# EasyEDA Pro project ProDocument_LN_CTRL_V1_2026-03-25.epro, schematic Schematic1, sheets 4 to 5 of 5

## Sheets
4 ADC: Create Date: 2026-01-05; Page Name: ADC; Project Name: ProDocument_LN_CTRL_V1; Update Date: 2026-01-05
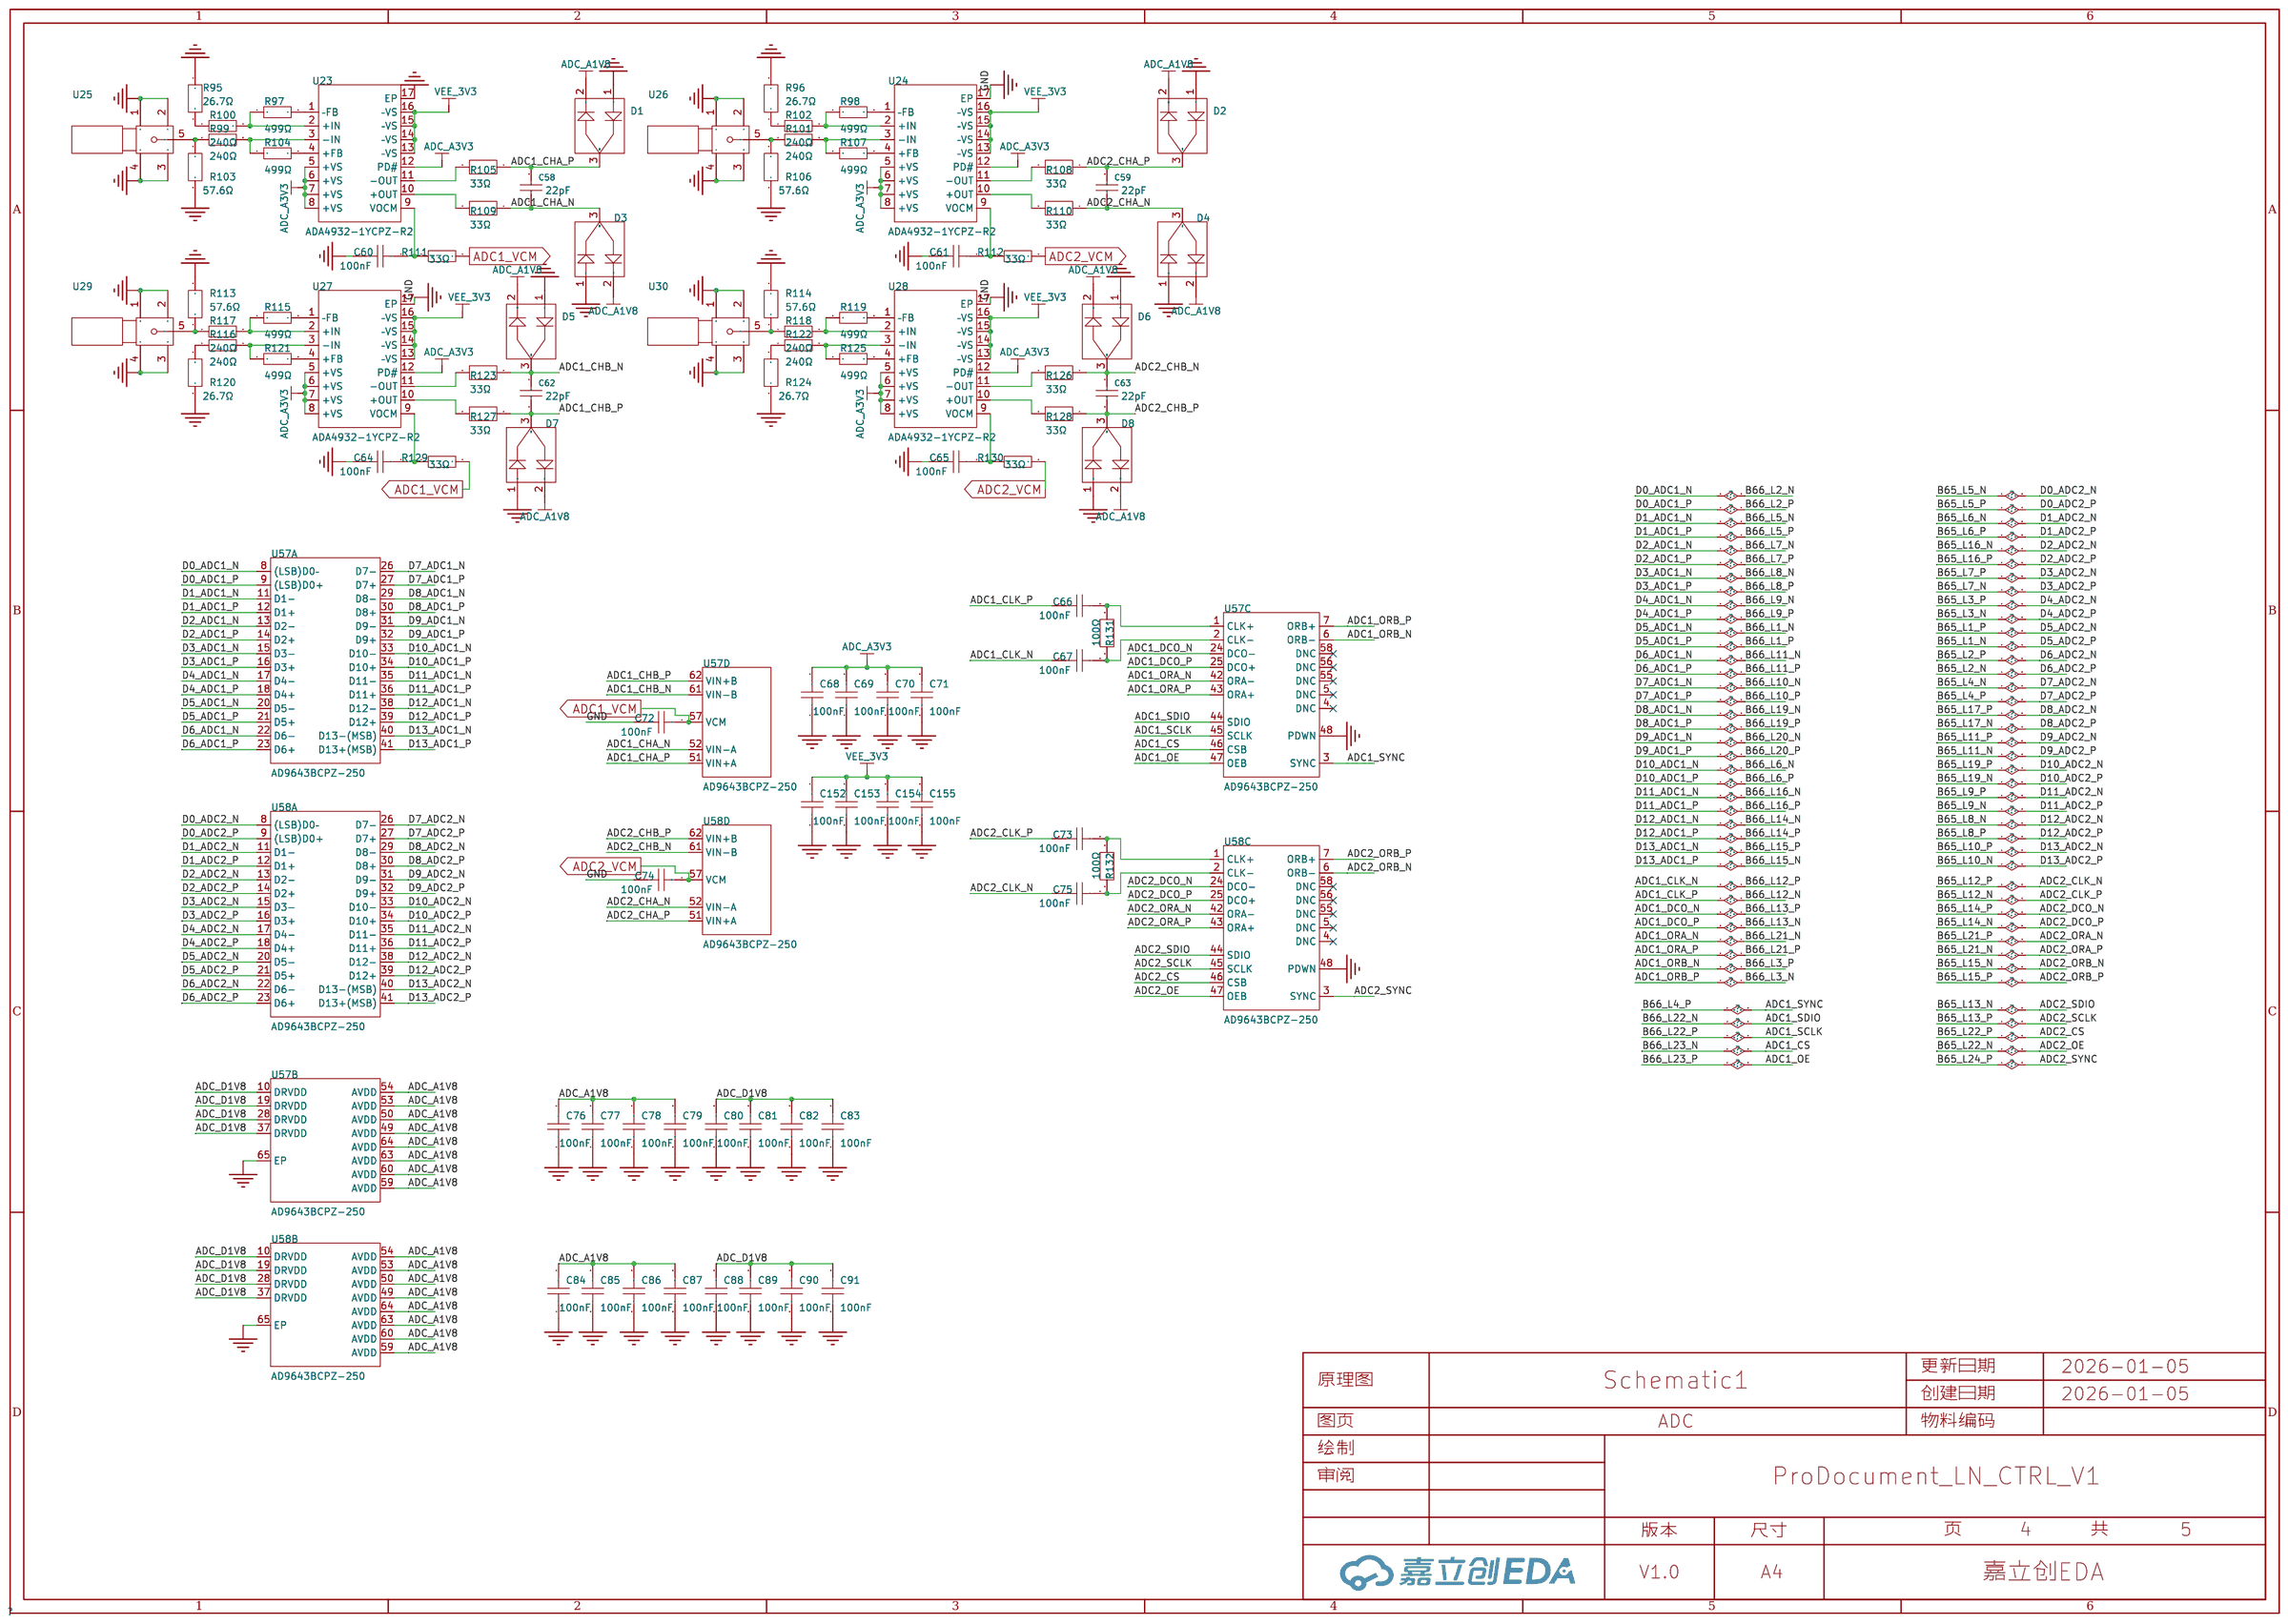
[diagram p3: ADC]
5 POWER: Create Date: 2026-01-05; Page Name: POWER; Project Name: ProDocument_LN_CTRL_V1; Update Date: 2026-01-05
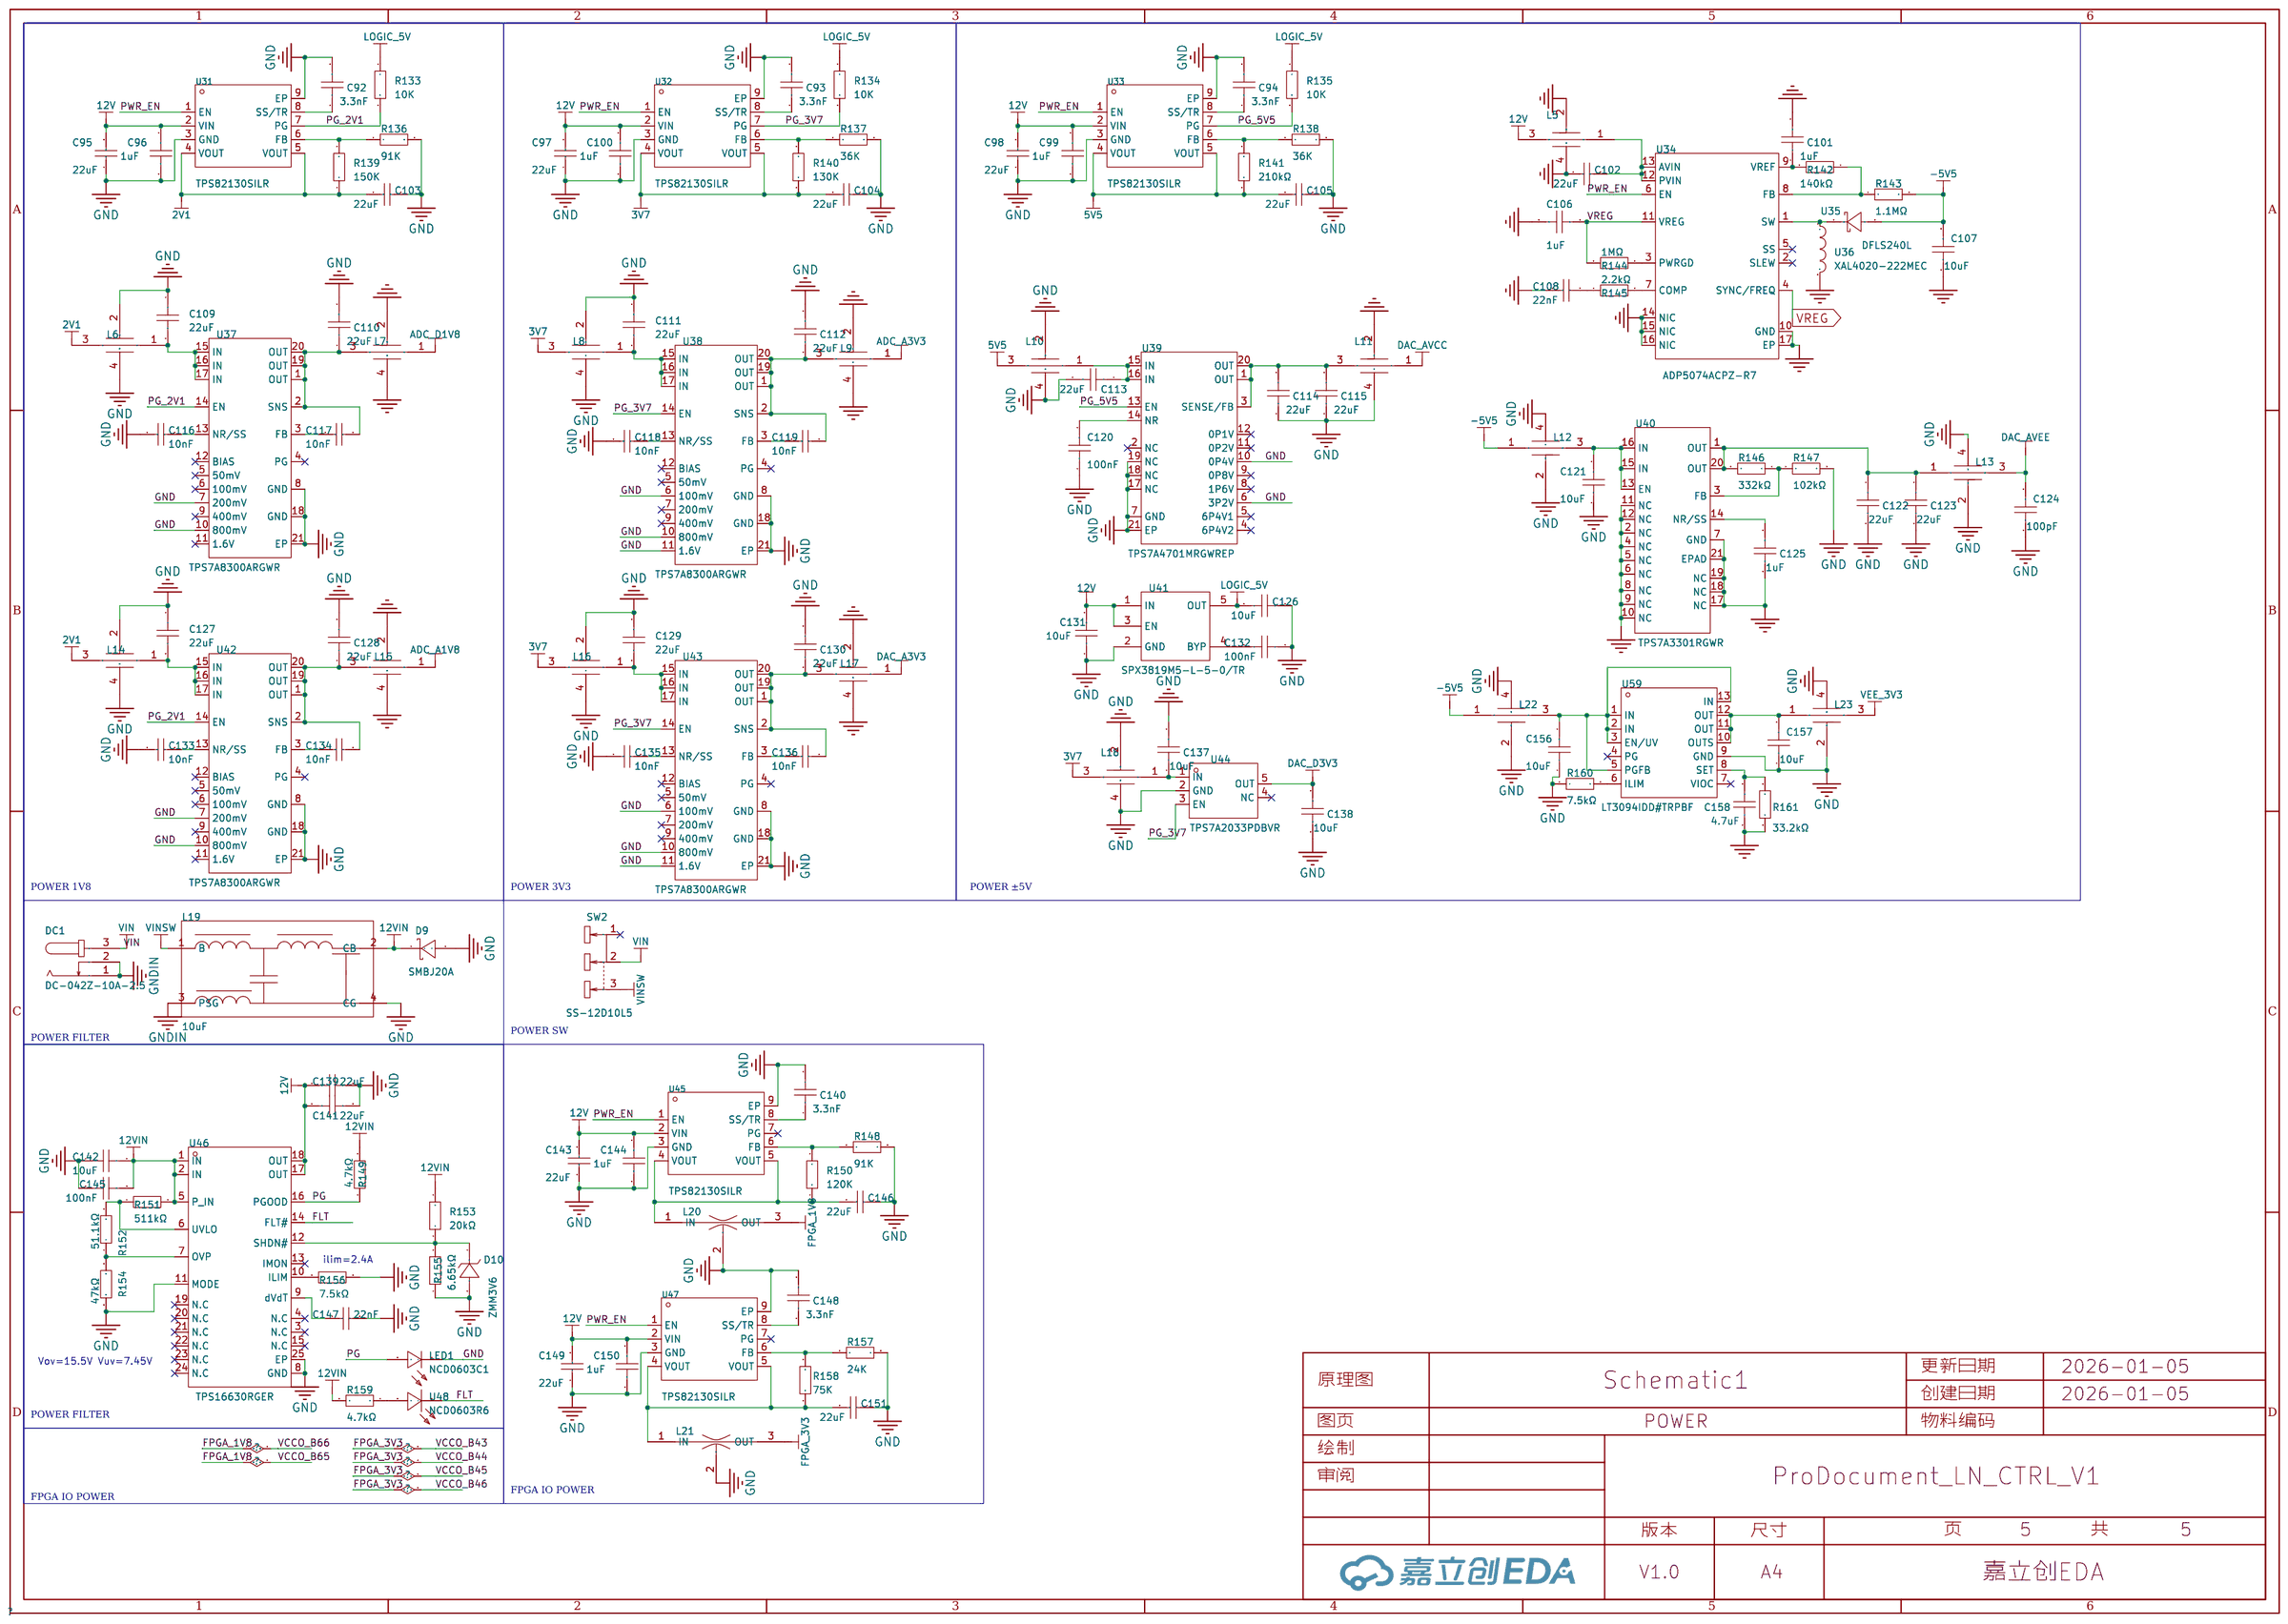
[diagram p4: POWER]

## Parts
sheet ADC
C58  22pF  [C0402]
C59  22pF  [C0402]
C60  100nF  [C0402]
C61  100nF  [C0402]
C62  22pF  [C0402]
C63  22pF  [C0402]
C64  100nF  [C0402]
C65  100nF  [C0402]
C66  100nF  [C0402]
C67  100nF  [C0402]
C68  100nF  [C0402]
C69  100nF  [C0402]
C70  100nF  [C0402]
C71  100nF  [C0402]
C72  100nF  [C0402]
C73  100nF  [C0402]
C74  100nF  [C0402]
C75  100nF  [C0402]
C76  100nF  [C0402]
C77  100nF  [C0402]
C78  100nF  [C0402]
C79  100nF  [C0402]
C80  100nF  [C0402]
C81  100nF  [C0402]
C82  100nF  [C0402]
C83  100nF  [C0402]
C84  100nF  [C0402]
C85  100nF  [C0402]
C86  100nF  [C0402]
C87  100nF  [C0402]
C88  100nF  [C0402]
C89  100nF  [C0402]
C90  100nF  [C0402]
C91  100nF  [C0402]
C152  100nF  [C0402]
C153  100nF  [C0402]
C154  100nF  [C0402]
C155  100nF  [C0402]
D1  NSVR351SDSA3T1G  [SC-59-3_L2.9-W1.5-P0.95-LS2.5-BR]
D2  NSVR351SDSA3T1G  [SC-59-3_L2.9-W1.5-P0.95-LS2.5-BR]
D3  NSVR351SDSA3T1G  [SC-59-3_L2.9-W1.5-P0.95-LS2.5-BR]
D4  NSVR351SDSA3T1G  [SC-59-3_L2.9-W1.5-P0.95-LS2.5-BR]
D5  NSVR351SDSA3T1G  [SC-59-3_L2.9-W1.5-P0.95-LS2.5-BR]
D6  NSVR351SDSA3T1G  [SC-59-3_L2.9-W1.5-P0.95-LS2.5-BR]
D7  NSVR351SDSA3T1G  [SC-59-3_L2.9-W1.5-P0.95-LS2.5-BR]
D8  NSVR351SDSA3T1G  [SC-59-3_L2.9-W1.5-P0.95-LS2.5-BR]
R95  26.7Ω  [R0402]
R96  26.7Ω  [R0402]
R97  499Ω  [R0402]
R98  499Ω  [R0402]
R99  240Ω  [R0402]
R100  240Ω  [R0402]
R101  240Ω  [R0402]
R102  240Ω  [R0402]
R103  57.6Ω  [R0402]
R104  499Ω  [R0402]
R105  33Ω  [R0402]
R106  57.6Ω  [R0402]
R107  499Ω  [R0402]
R108  33Ω  [R0402]
R109  33Ω  [R0402]
R110  33Ω  [R0402]
R111  33Ω  [R0402]
R112  33Ω  [R0402]
R113  57.6Ω  [R0402]
R114  57.6Ω  [R0402]
R115  499Ω  [R0402]
R116  240Ω  [R0402]
R117  240Ω  [R0402]
R118  240Ω  [R0402]
R119  499Ω  [R0402]
R120  26.7Ω  [R0402]
R121  499Ω  [R0402]
R122  240Ω  [R0402]
R123  33Ω  [R0402]
R124  26.7Ω  [R0402]
R125  499Ω  [R0402]
R126  33Ω  [R0402]
R127  33Ω  [R0402]
R128  33Ω  [R0402]
R129  33Ω  [R0402]
R130  33Ω  [R0402]
R131  100Ω  [R0402]
R132  100Ω  [R0402]
U23  ADA4932-1YCPZ-R2  [LFCSP-16_L3.0-W3.0-P0.50-BL-EP1.3]
U24  ADA4932-1YCPZ-R2  [LFCSP-16_L3.0-W3.0-P0.50-BL-EP1.3]
U25  -  [MOLEX_SMA]
U26  -  [MOLEX_SMA]
U27  ADA4932-1YCPZ-R2  [LFCSP-16_L3.0-W3.0-P0.50-BL-EP1.3]
U28  ADA4932-1YCPZ-R2  [LFCSP-16_L3.0-W3.0-P0.50-BL-EP1.3]
U29  -  [MOLEX_SMA]
U30  -  [MOLEX_SMA]
U57  AD9643BCPZ-250  [LFCSP-64_L9.0-W9.0-P0.50-BL-EP6.2]  (sections 1,2,3,4)
U58  AD9643BCPZ-250  [LFCSP-64_L9.0-W9.0-P0.50-BL-EP6.2]  (sections 1,2,3,4)
sheet POWER
C92  3.3nF  [C0402]
C93  3.3nF  [C0402]
C94  3.3nF  [C0402]
C95  22uF  [C0805]
C96  1uF  [C0402]
C97  22uF  [C0805]
C98  22uF  [C0805]
C99  1uF  [C0402]
C100  1uF  [C0402]
C101  1uF  [C0603]
C102  22uF  [C0805]
C103  22uF  [C0805]
C104  22uF  [C0805]
C105  22uF  [C0805]
C106  1uF  [C0603]
C107  10uF  [C0603]
C108  22nF  [C0402]
C109  22uF  [C0805]
C110  22uF  [C0805]
C111  22uF  [C0805]
C112  22uF  [C0805]
C113  22uF  [C0805]
C114  22uF  [C0805]
C115  22uF  [C0805]
C116  10nF  [C0402]
C117  10nF  [C0402]
C118  10nF  [C0402]
C119  10nF  [C0402]
C120  100nF  [C0402]
C121  10uF  [C0603]
C122  22uF  [C0805]
C123  22uF  [C0805]
C124  100pF  [C0402]
C125  1uF  [C0603]
C126  10uF  [C0603]
C127  22uF  [C0805]
C128  22uF  [C0805]
C129  22uF  [C0805]
C130  22uF  [C0805]
C131  10uF  [C0603]
C132  100nF  [C0402]
C133  10nF  [C0402]
C134  10nF  [C0402]
C135  10nF  [C0402]
C136  10nF  [C0402]
C137  10uF  [C0603]
C138  10uF  [C0603]
C139  22uF  [C1206]
C140  3.3nF  [C0402]
C141  22uF  [C1206]
C142  10uF  [C0805]
C143  22uF  [C0805]
C144  1uF  [C0402]
C145  100nF  [C0402]
C146  22uF  [C0805]
C147  22nF  [C0402]
C148  3.3nF  [C0402]
C149  22uF  [C0805]
C150  1uF  [C0402]
C151  22uF  [C0805]
C156  10uF  [C0603]
C157  10uF  [C0603]
C158  4.7uF  [C0402]
D9  SMBJ20A  [SMB_L4.5-W3.7-LS5.4-RD]
D10  ZMM3V6  [LL-34_L3.5-W1.5-RD]
DC1  DC-042Z-10A-2.5  [DC-IN-TH_DC-042C-Z-2.5-A]
L5  NFM21PC104R1E3D  [CAP-SMD_4P-L2.0-W1.25]
L6  NFM21PC104R1E3D  [CAP-SMD_4P-L2.0-W1.25]
L7  NFM21PC104R1E3D  [CAP-SMD_4P-L2.0-W1.25]
L8  NFM21PC104R1E3D  [CAP-SMD_4P-L2.0-W1.25]
L9  NFM21PC104R1E3D  [CAP-SMD_4P-L2.0-W1.25]
L10  NFM21PC104R1E3D  [CAP-SMD_4P-L2.0-W1.25]
L11  NFM21PC104R1E3D  [CAP-SMD_4P-L2.0-W1.25]
L12  NFM21PC104R1E3D  [CAP-SMD_4P-L2.0-W1.25]
L13  NFM21PC104R1E3D  [CAP-SMD_4P-L2.0-W1.25]
L14  NFM21PC104R1E3D  [CAP-SMD_4P-L2.0-W1.25]
L15  NFM21PC104R1E3D  [CAP-SMD_4P-L2.0-W1.25]
L16  NFM21PC104R1E3D  [CAP-SMD_4P-L2.0-W1.25]
L17  NFM21PC104R1E3D  [CAP-SMD_4P-L2.0-W1.25]
L18  NFM21PC104R1E3D  [CAP-SMD_4P-L2.0-W1.25]
L19  10uF  [FILTER-SMD_BNX026H01L]
L20  NFM18PC105R0J3D  [FILTER-SMD_3P-L1.6-W0.8-L]
L21  NFM18PC105R0J3D  [FILTER-SMD_3P-L1.6-W0.8-L]
L22  NFM21PC104R1E3D  [CAP-SMD_4P-L2.0-W1.25]
L23  NFM21PC104R1E3D  [CAP-SMD_4P-L2.0-W1.25]
LED1  NCD0603C1  [LED0603-RD]
R133  10K  [R0402]
R134  10K  [R0402]
R135  10K  [R0402]
R136  91K  [R0402]
R137  36K  [R0402]
R138  36K  [R0402]
R139  150K  [R0402]
R140  130K  [R0402]
R141  210kΩ  [R0402]
R142  140kΩ  [R0402]
R143  1.1MΩ  [R0402]
R144  1MΩ  [R0402]
R145  2.2kΩ  [R0402]
R146  332kΩ  [R0402]
R147  102kΩ  [R0402]
R148  91K  [R0402]
R149  4.7kΩ  [R0402]
R150  120K  [R0402]
R151  511kΩ  [R0402]
R152  51.1kΩ  [R0402]
R153  20kΩ  [R0402]
R154  47kΩ  [R0402]
R155  6.65kΩ  [R0402]
R156  7.5kΩ  [R0402]
R157  24K  [R0402]
R158  75K  [R0402]
R159  4.7kΩ  [R0402]
R160  7.5kΩ  [R0402]
R161  33.2kΩ  [R0402]
SW2  SS-12D10L5  [SW-TH_SS-12D10L5]
U31  TPS82130SILR  [USIP-8_L3.0-W2.8-P0.65-TL-EP]
U32  TPS82130SILR  [USIP-8_L3.0-W2.8-P0.65-TL-EP]
U33  TPS82130SILR  [USIP-8_L3.0-W2.8-P0.65-TL-EP]
U34  ADP5074ACPZ-R7  [LFCSP-16_L3.0-W3.0-P0.50-BL-EP1.7]
U35  DFLS240L  [POWERDI-123_L2.8-W1.8-LS3.7-RD]
U36  XAL4020-222MEC  [IND-SMD_L4.0-W4.0-A]
U37  TPS7A8300ARGWR  [VQFN-20_L5.0-W5.0-P0.65-TL-EP3.2]
U38  TPS7A8300ARGWR  [VQFN-20_L5.0-W5.0-P0.65-TL-EP3.2]
U39  TPS7A4701MRGWREP  [VQFN-20_L5.0-W5.0-P0.65-TL-EP3.2]
U40  TPS7A3301RGWR  [VQFN-20_L5.0-W5.0-P0.65-TL-EP]
U41  SPX3819M5-L-5-0/TR  [SOT-23-5_L3.0-W1.7-P0.95-LS2.8-BL]
U42  TPS7A8300ARGWR  [VQFN-20_L5.0-W5.0-P0.65-TL-EP3.2]
U43  TPS7A8300ARGWR  [VQFN-20_L5.0-W5.0-P0.65-TL-EP3.2]
U44  TPS7A2033PDBVR  [SOT-23-5_L2.9-W1.6-P0.95-LS2.8-BR]
U45  TPS82130SILR  [USIP-8_L3.0-W2.8-P0.65-TL-EP]
U46  TPS16630RGER  [VFQFPN-24_L4.0-W4.0-P0.50-BL-EP2.8]
U47  TPS82130SILR  [USIP-8_L3.0-W2.8-P0.65-TL-EP]
U48  NCD0603R6  [LED0603-RD]
U59  LT3094IDD#TRPBF  [DFN-12_L3.0-W3.0-P0.45-BL-EP-1]

## Library data of the parts
C58 C59 C62 C63 = 0402CG220J500NT: 容值:22pF;精度:±5%;额定电压:50V;材质(温度系数):C0G;; LCSC Part Name: 22pF ±5% 50V; Supplier Part: C1555; Manufacturer: FH(风华); Supplier Footprint: 0402; JLCPCB Part Class: 基础库; Datasheet: https://atta.szlcsc.com/upload/public/pdf/source/20200305/C486355_26A10D38EF8C2A5C37091D0039909270.pdf; Supplier: LCSC; Tolerance: ±5%; Voltage Rated: 50V; Temperature Coefficient: C0G
C60 C61 C64-C91 C120 C132 C145 C152-C155 = GRM155R71H104KE14D: 容值:100nF;精度:±10%;额定电压:50V;材质(温度系数):X7R;; LCSC Part Name: 100nF ±10% 50V; Supplier Part: C77020; Manufacturer: muRata(村田); Supplier Footprint: 0402; JLCPCB Part Class: 扩展库; Datasheet: https://atta.szlcsc.com/upload/public/pdf/source/20180326/C77020_39BD49C951FF1AF0DB1F1FAC5AC1E401.pdf; Supplier: LCSC; Tolerance: ±10%; Voltage Rated: 50V; Temperature Coefficient: X7R
D1-D8 = NSVR351SDSA3T1G: 二极管配置:1对串联式;正向压降(Vf):230mV@1mA;直流反向耐压(Vr):5V;整流电流:30mA;; LCSC Part Name: 电压:5V 电流:30mA; Supplier Part: C604385; Manufacturer: onsemi(安森美); Supplier Footprint: SC-59; JLCPCB Part Class: 扩展库; Datasheet: https://item.szlcsc.com/datasheet/NSVR351SDSA3T1G/633813.html; Supplier: LCSC; Diode Configuration: 1对串联式; Voltage - Forward(Vf@If): 230mV@1mA; Voltage - DC Reverse(Vr): 5V; Current - Rectified: 30mA; Reverse Leakage Current (Ir): 25uA@0.5V
R95 R96 R103 R105 R106 R108-R110 R113 R114 R120 R123 R124 R126-R128 = ARG02BTC1001: 阻值:1kΩ;精度:±0.1%;温度系数:±25ppm/;; LCSC Part Name: 1kΩ ±0.1%; Supplier Part: C2984405; Manufacturer: Viking(光颉); Supplier Footprint: 0402; Datasheet: https://atta.szlcsc.com/upload/public/pdf/source/20200117/C485675_99063924B4564AF910B7BE66DA8EFA49.pdf; Supplier: LCSC; Tolerance: ±0.1%; Temperature Coefficient: ±25ppm/
R97 R98 R104 R107 R115 R119 R121 R125 = 0402WGF4990TCE: 电阻类型:厚膜电阻;阻值:499Ω;精度:±1%;功率:62.5mW;最大工作电压:50V;温度系数:±100ppm/℃;; LCSC Part Name: 499Ω ±1% 62.5mW 厚膜电阻; Supplier Part: C4125; Manufacturer: UNI-ROYAL(厚声); Supplier Footprint: 0402; JLCPCB Part Class: 扩展库; Datasheet: https://atta.szlcsc.com/upload/public/pdf/source/20200306/C422600_1E6D84923E4A46A82E41ADD87F860B5C.pdf; Supplier: LCSC; Type: 厚膜电阻; Tolerance: ±1%; Power(Watts): 62.5mW; Overload Voltage (Max): 50V; Temperature Coefficient: ±100ppm/℃; Operating Temperature Range: -55℃~+155℃
R99-R102 R116-R118 R122 = 0402WGF2400TCE: 电阻类型:厚膜电阻;阻值:240Ω;精度:±1%;功率:62.5mW;最大工作电压:50V;温度系数:±100ppm/℃;; LCSC Part Name: 240Ω ±1% 62.5mW 厚膜电阻; Supplier Part: C25094; Manufacturer: UNI-ROYAL(厚声); Supplier Footprint: 0402; JLCPCB Part Class: 扩展库; Datasheet: https://atta.szlcsc.com/upload/public/pdf/source/20200306/C422600_1E6D84923E4A46A82E41ADD87F860B5C.pdf; Supplier: LCSC; Type: 厚膜电阻; Tolerance: ±1%; Power(Watts): 62.5mW; Overload Voltage (Max): 50V; Temperature Coefficient: ±100ppm/℃; Operating Temperature Range: -55℃~+155℃
R111 R112 R129 R130 = 0402WGF330JTCE: 电阻类型:厚膜电阻;阻值:33Ω;精度:±1%;功率:62.5mW;工作电压:50V;温度系数:±100ppm/℃;; LCSC Part Name: 33Ω ±1% 62.5mW 厚膜电阻; Supplier Part: C25105; Manufacturer: UNI-ROYAL(厚声); Supplier Footprint: 0402; JLCPCB Part Class: 基础库; Datasheet: https://item.szlcsc.com/datasheet/0402WGF330JTCE/25848.html; Supplier: LCSC; Type: 厚膜电阻; Tolerance: ±1%; Power(Watts): 62.5mW; Voltage-Supply(Max): 50V; Temperature Coefficient: ±100ppm/℃; Operating Temperature: -55℃~+155℃
R131 R132 = RT0402BRD07100RL: 电阻类型:薄膜电阻;阻值:100Ω;精度:±0.1%;功率:62.5mW;工作电压:50V;温度系数:±25ppm/℃;; LCSC Part Name: 薄膜电阻 100Ω ±0.1% 62.5mW; Supplier Part: C705627; Manufacturer: YAGEO(国巨); Supplier Footprint: 0402; JLCPCB Part Class: 扩展库; Datasheet: https://atta.szlcsc.com/upload/public/pdf/source/20250609/0E6D5617EADA80FA3B707391883DF2D5.pdf; Supplier: LCSC; Type: 薄膜电阻; Tolerance: ±0.1%; Power(Watts): 62.5mW; Voltage-Supply(Max): 50V; Temperature Coefficient: ±25ppm/℃; Operating Temperature: -55℃~+155℃
U23 U24 U27 U28 = ADA4932-1YCPZ-R2: 放大器数:单路;共模抑制比(CMRR):100dB;输入偏置电流(Ib):2.5uA;输入失调电压(Vos):500uV;增益带宽积(GBP):-;压摆率(SR):2800V/us;带宽(-3db):560MHz;; LCSC Part Name: 高性能低功耗差分ADC驱动器; Supplier Part: C494505; Manufacturer: ADI(亚德诺); Supplier Footprint: LFCSP-16(3x3); JLCPCB Part Class: 扩展库; Datasheet: https://atta.szlcsc.com/upload/public/pdf/source/20200309/C494505_BB399B04ACF7E8080BF0845658E50F75.pdf; Supplier: LCSC; Number of Circuits: 单路; Common Mode Rejection Ratio (CMRR): 100dB; Current - Input Bias(Ib): 2.5uA; Voltage - Input Offset(Vos): 500uV; Slew Rate(SR): 2800V/us; Supply Voltage: 3V~5V; -3db Bandwidth: 560MHz; Input Offset Voltage Drift (Vos TC): 3.7uV/℃; Supply Current: 9.6mA; Operating Temperature: -40℃~+105℃
U25 U26 U29 U30 = MOLEX_SMA: C296128
U57 U58 = AD9643BCPZ-250: 接口:并行;电源电压:1.7V~1.9V;采样率:250MHz;分辨率:14;; LCSC Part Name: 14位，170 MSPS/210 MSPS/250 MSPS，1.8 V 双通道模数转换器（ADC）; Supplier Part: C653687; Manufacturer: ADI(亚德诺); Supplier Footprint: LFCSP-64(9x9); JLCPCB Part Class: 扩展库; Datasheet: https://atta.szlcsc.com/upload/public/pdf/source/20210202/C653686_A37F23B3A48DA588C28A43E276C751ED.pdf; Supplier: LCSC; Interface: 并行; differential input: 是; number of channels: 2; Supply Voltage: 1.7V~1.9V; sampling frequency: 250MHz; resolution: 14; Operating Temperature: -40℃~+85℃
C92-C94 C124 C140 C148 = CAP_0402: Supplier Footprint: 0402
C95 C97 C98 C102-C105 C143 C146 C149 C151 = GRM21BR61E226ME44L: 容值:22uF;精度:±20%;额定电压:25V;温度系数:X5R;; LCSC Part Name: 22uF ±20% 25V; Supplier Part: C86816; Manufacturer: muRata(村田); Supplier Footprint: 0805; JLCPCB Part Class: 扩展库; Datasheet: https://item.szlcsc.com/datasheet/GRM21BR61E226ME44L/87993.html; Supplier: LCSC; Tolerance: ±20%; Voltage Rating: 25V; Temperature Coefficient: X5R
C96 C99 C100 C144 C150 = CL05X105KA5NQNC: 容值:1uF;精度:±10%;额定电压:25V;材质(温度系数):X6S;; LCSC Part Name: 1uF ±10% 25V; Supplier Part: C307454; Manufacturer: SAMSUNG(三星); Supplier Footprint: 0402; JLCPCB Part Class: Extended Part; Datasheet: https://atta.szlcsc.com/upload/public/pdf/source/20160218/1457707763339.pdf; Supplier: LCSC; Tolerance: ±10%; Voltage Rated: 25V; Temperature Coefficient: X6S
C101 C106 C125 = GCM188R71E105KA64D: 容值:1uF;精度:±10%;额定电压:25V;温度系数:X7R;; LCSC Part Name: 1uF ±10% 25V; Supplier Part: C85862; Manufacturer: muRata(村田); Supplier Footprint: 0603; JLCPCB Part Class: 扩展库; Datasheet: https://item.szlcsc.com/datasheet/GCM188R71E105KA64D/87038.html; Supplier: LCSC; Tolerance: ±10%; Voltage Rating: 25V; Temperature Coefficient: X7R
C107 C121 C137 C138 C156 C157 = GRM188Z71A106KA73D: 容值:10uF;精度:±10%;额定电压:10V;材质(温度系数):X7R;; LCSC Part Name: 10uF ±10% 10V; Supplier Part: C2959727; Manufacturer: muRata(村田); Supplier Footprint: 0603; JLCPCB Part Class: 扩展库; Datasheet: https://atta.szlcsc.com/upload/public/pdf/source/20220328/6A4892B7E841253269A84FFE395E0578.pdf; Supplier: LCSC; Tolerance: ±10%; Voltage Rated: 10V; Temperature Coefficient: X7R
C108 C147 = GRM155R71H223KA12D: 容值:22nF;精度:±10%;额定电压:50V;材质(温度系数):X7R;; LCSC Part Name: 22nF ±10% 50V; Supplier Part: C77023; Manufacturer: muRata(村田); Supplier Footprint: 0402; JLCPCB Part Class: 扩展库; Datasheet: https://atta.szlcsc.com/upload/public/pdf/source/20180326/C77023_485AB0D0559A254D360F85D8E7719291.pdf; Supplier: LCSC; Tolerance: ±10%; Voltage Rated: 50V; Temperature Coefficient: X7R
C109-C112 C127-C130 = CL21A226MAQNNNE_C45783: 容值:22uF;精度:±20%;额定电压:25V;材质(温度系数):X5R;; LCSC Part Name: 22uF ±20% 25V; Supplier Part: C45783; Manufacturer: SAMSUNG(三星); Manufacturer Part: CL21A226MAQNNNE; Supplier Footprint: 0805; JLCPCB Part Class: 基础库; Datasheet: https://atta.szlcsc.com/upload/public/pdf/source/20160103/1457707727161.pdf; Supplier: LCSC; Tolerance: ±20%; Voltage Rated: 25V; Temperature Coefficient: X5R
C113-C115 = GRM21BC81C226ME44L: 容值:22uF;精度:±20%;额定电压:16V;材质(温度系数):X6S;; LCSC Part Name: 22uF ±20% 16V; Supplier Part: C258782; Manufacturer: muRata(村田); Supplier Footprint: 0805; JLCPCB Part Class: 扩展库; Datasheet: https://atta.szlcsc.com/upload/public/pdf/source/20200117/C258782_354729B55DBAD136BAA783E298FE5367.pdf; Supplier: LCSC; Tolerance: ±20%; Voltage Rated: 16V; Temperature Coefficient: X6S
C116-C119 C133-C136 = CL05B103KB5NNNC: 容值:10nF;精度:±10%;额定电压:50V;材质(温度系数):X7R;; LCSC Part Name: 10nF ±10% 50V; Supplier Part: C15195; Manufacturer: SAMSUNG(三星); Supplier Footprint: 0402; JLCPCB Part Class: 基础库; Datasheet: https://atta.szlcsc.com/upload/public/pdf/source/20160218/1457707763339.pdf; Supplier: LCSC; Tolerance: ±10%; Voltage Rated: 50V; Temperature Coefficient: X7R
C122 C123 = CAP_0805: Supplier Footprint: 0805
C126 C131 = CAP_0603: Supplier Footprint: 0603
C139 C141 = CGA1206X5R226M350NT: 容值:22uF;精度:±20%;额定电压:35V;材质(温度系数):X5R;; LCSC Part Name: 22uF ±20% 35V; Supplier Part: C6119969; Manufacturer: HRE(芯声); Supplier Footprint: 1206; JLCPCB Part Class: 扩展库; Supplier: LCSC; Tolerance: ±20%; Voltage Rated: 35V; Temperature Coefficient: X5R
C142 = GRM21BR61H106KE43L: 容值:10uF;精度:±10%;额定电压:50V;材质(温度系数):X5R;; LCSC Part Name: 10uF ±10% 50V; Supplier Part: C440198; Manufacturer: muRata(村田); Supplier Footprint: 0805; JLCPCB Part Class: 基础库; Datasheet: https://atta.szlcsc.com/upload/public/pdf/source/20230811/95AAE0C9AF55EDC31B7A4D8B733F534E.pdf; Supplier: LCSC; Tolerance: ±10%; Voltage Rated: 50V; Temperature Coefficient: X5R
C158 = GRM155R61E475ME15D: 容值:4.7uF;精度:±20%;额定电压:25V;温度系数:X5R;; LCSC Part Name: 4.7uF ±20% 25V; Supplier Part: C2858031; Manufacturer: muRata(村田); Supplier Footprint: 0402; JLCPCB Part Class: 扩展库; Datasheet: https://item.szlcsc.com/datasheet/GRM155R61E475ME15D/3058877.html; Supplier: LCSC; Tolerance: ±20%; Voltage Rating: 25V; Temperature Coefficient: X5R
D9 = SMBJ20A_C151922: 反向截止电压(Vrwm):20V;最大钳位电压:32.4V;峰值脉冲电流(Ipp)@10/1000us:18.6A;击穿电压:22.2V;; Supplier Part: C151922; Manufacturer: BORN(伯恩半导体); Supplier Footprint: SMB; JLCPCB Part Class: 扩展库; Datasheet: https://atta.szlcsc.com/upload/public/pdf/source/20200413/C152089_47B9F2142CBB08C8573970559A15E9B6.pdf; Supplier: LCSC; Reverse Stand-Off Voltage (Vrwm): 20V; Maximum Clamping Voltage: 32.4V; Peak Pulse Current (Ipp)@10/1000us: 18.6A; Breakdown Voltage: 22.2V; Type: TVS
D10 = ZMM3V6_1: 二极管配置:独立式;稳压值(标称值):3.6V;稳压值(范围):3.4V~3.8V;功率(Pd):500mW;; Supplier Part: C5345988; Manufacturer: HXY MOSFET(华轩阳电子); Supplier Footprint: LL-34; JLCPCB Part Class: 扩展库; Datasheet: https://atta.szlcsc.com/upload/public/pdf/source/20240618/16C526453F44576F0942DF21C8FF248D.pdf; Supplier: LCSC; Diode Configuration: 独立式; Zener Voltage (Nom): 3.6V; Reverse Leakage Current (Ir): 2uA@1V; Zener Voltage (Range): 3.4V~3.8V; Power Dissipation: 500mW; Zener Impedance (Zzt): 85Ω
DC1 = DC-042Z-10A-2.5: 连接器类型:DC电源插座;安装方式:弯插;触点内径:2.5mm;触点外径:6mm;额定电流:10A;额定电压:20V;工作温度:-20℃~+70℃;; LCSC Part Name: 不带开关 DC电源插座 内径:2.5mm 外径:6mm; Supplier Part: C706901; Manufacturer: XKB Connection(中国星坤); Supplier Footprint: 插件; JLCPCB Part Class: 扩展库; Datasheet: https://item.szlcsc.com/datasheet/DC-042Z-10A-2.5/744023.html; Supplier: LCSC; Connector Type: DC电源插座; Mounting Type: 弯插; Inside Contact Diameter: 2.5mm; Outside Contact Diameter: 6mm; Current Rating: 10A; Voltage Rating (Max): 20V; Operating Temperature: -20℃~+70℃
L5-L18 L22 L23 = NFM21PC104R1E3D: 电容量:100nF;精度:±20%;直流电阻:30mΩ;; LCSC Part Name: 100nF(104) ±20% 25V; Supplier Part: C86150; Manufacturer: muRata(村田); Supplier Footprint: 0805; JLCPCB Part Class: 扩展库; Datasheet: https://atta.szlcsc.com/upload/public/pdf/source/20180326/C86150_E4B7366323682FA84DED9003C68CA797.pdf; Supplier: LCSC; Nominal Capacitance: 100nF; CapacitanceTolerance: ±20%; DC Rated Voltage: 25V; Rated Current: 2A; DC Resistance: 30mΩ; Operating Temperature: -55℃~+125℃
L19 = BNX026H01L: 滤波器阶数:5;阻值:0.43mΩ;容值:10uF;通道数:2;; Supplier Part: C80505; Manufacturer: muRata(村田); Supplier Footprint: SMD-4P,12.1x9.1mm; JLCPCB Part Class: 扩展库; Datasheet: https://item.szlcsc.com/datasheet/BNX026H01L/81651.html; Supplier: LCSC; Voltage Rating: 50V; Current Rating: 20A; Filter Order: 5; ESD Protection: 无; Number of Channels: 2; Attenuation Value: 35dB@50kHz~1GHz; Operating Temperature: -55℃~+125℃
L20 L21 = NFM18PC105R0J3D: 电容量:1uF;精度:±20%;直流电阻:10mΩ;; LCSC Part Name: 1uF(105) ±20% 6.3V; Supplier Part: C98103; Manufacturer: muRata(村田); Supplier Footprint: SMD-3P,0.8x1.6mm; JLCPCB Part Class: Extended Part; Datasheet: https://atta.szlcsc.com/upload/public/pdf/source/20180326/C98103_AFDAA7B32FFEB0E0991B58DAC44FEBA2.pdf; Supplier: LCSC; Nominal Capacitance: 1uF; CapacitanceTolerance: ±20%; DC Rated Voltage: 6.3V; Rated Current: 4A; DC Resistance: 10mΩ; Operating Temperature: -55℃~+105℃
LED1 = NCD0603C1: 灯头类型:-;发光颜色:黄绿色;正向压降(Vf):1.6V~2.6V;功率:65mW;正向电流:25mA;波长:565nm~578nm;二极管配置:-;透镜颜色:-;色温:-;发光强度:13mcd;发光角度:140°;载带方式:-;工作温度:-30℃~+85℃;; LCSC Part Name: 片式发光二极管; Supplier Part: C84264; Manufacturer: 国星光电; Supplier Footprint: 0603; JLCPCB Part Class: 扩展库; Datasheet: https://item.szlcsc.com/datasheet/NCD0603C1/85433.html; Supplier: LCSC; Illumination Color: 黄绿色; Voltage - Forward(Vf): 1.6V~2.6V; Power(Watts): 65mW; Forward Current: 25mA; Wavelength - Dominant: 565nm~578nm; Peak Wavelength: 576nm; Luminous Intensity: 13mcd; Viewing Angle: 140°; Operating Temperature: -30℃~+85℃
R133-R140 R148 R150 R157 R158 = Res_0402: Supplier Footprint: 0402
R141 = RC0402FR-07210KL: 电阻类型:厚膜电阻;阻值:210kΩ;精度:±1%;功率:62.5mW;最大工作电压:50V;温度系数:±100ppm/℃;; LCSC Part Name: 厚膜电阻 210kΩ ±1% 62.5mW; Supplier Part: C273331; Manufacturer: YAGEO(国巨); Supplier Footprint: 0402; JLCPCB Part Class: 扩展库; Datasheet: https://atta.szlcsc.com/upload/public/pdf/source/20180821/C275644_0D56F95EFF785E7D9A1FEF436B37DA78.pdf; Supplier: LCSC; Type: 厚膜电阻; Tolerance: ±1%; Power(Watts): 62.5mW; Overload Voltage (Max): 50V; Temperature Coefficient: ±100ppm/℃; Operating Temperature Range: -55℃~+155℃
R142 = 0402WGF1403TCE: 电阻类型:厚膜电阻;阻值:140kΩ;精度:±1%;功率:62.5mW;最大工作电压:50V;温度系数:±100ppm/℃;; LCSC Part Name: 140kΩ ±1% 62.5mW 厚膜电阻; Supplier Part: C270645; Manufacturer: UNI-ROYAL(厚声); Supplier Footprint: 0402; JLCPCB Part Class: 扩展库; Datasheet: https://atta.szlcsc.com/upload/public/pdf/source/20200306/C422600_1E6D84923E4A46A82E41ADD87F860B5C.pdf; Supplier: LCSC; Type: 厚膜电阻; Tolerance: ±1%; Power(Watts): 62.5mW; Overload Voltage (Max): 50V; Temperature Coefficient: ±100ppm/℃; Operating Temperature Range: -55℃~+155℃
R143 = 0402WGF1104TCE: 电阻类型:厚膜电阻;阻值:1.1MΩ;精度:±1%;功率:62.5mW;工作电压:50V;温度系数:±100ppm/℃;; LCSC Part Name: 1.1MΩ ±1% 62.5mW 厚膜电阻; Supplier Part: C133039; Manufacturer: UNI-ROYAL(厚声); Supplier Footprint: 0402; JLCPCB Part Class: 扩展库; Datasheet: https://item.szlcsc.com/datasheet/0402WGF1104TCE/144341.html; Supplier: LCSC; Type: 厚膜电阻; Tolerance: ±1%; Power(Watts): 62.5mW; Voltage-Supply(Max): 50V; Temperature Coefficient: ±100ppm/℃; Operating Temperature: -55℃~+155℃
R144 = 0402WGF1004TCE: 电阻类型:厚膜电阻;阻值:1MΩ;精度:±1%;功率:62.5mW;; LCSC Part Name: 1MΩ ±1% 62.5mW; Supplier Part: C26083; Manufacturer: UNI-ROYAL(厚声); Supplier Footprint: 0402; JLCPCB Part Class: 基础库; Datasheet: https://atta.szlcsc.com/upload/public/pdf/source/20200306/C422600_1E6D84923E4A46A82E41ADD87F860B5C.pdf; Supplier: LCSC; Type: 厚膜电阻; Tolerance: ±1%; Power(Watts): 62.5mW; Temperature Coefficient: ±100ppm/℃; Overload Voltage (Max): 50V; Operating Temperature Range: -55℃~+155℃
R145 = 0402WGF2201TCE: 电阻类型:厚膜电阻;阻值:2.2kΩ;精度:±1%;功率:62.5mW;工作电压:50V;温度系数:±100ppm/℃;; LCSC Part Name: 2.2kΩ ±1% 62.5mW 厚膜电阻; Supplier Part: C25879; Manufacturer: UNI-ROYAL(厚声); Supplier Footprint: 0402; JLCPCB Part Class: 基础库; Datasheet: https://item.szlcsc.com/datasheet/0402WGF2201TCE/26622.html; Supplier: LCSC; Type: 厚膜电阻; Tolerance: ±1%; Power(Watts): 62.5mW; Voltage-Supply(Max): 50V; Temperature Coefficient: ±100ppm/℃; Operating Temperature: -55℃~+155℃
R146 = 0402WGF3323TCE: 电阻类型:厚膜电阻;阻值:332kΩ;精度:±1%;功率:62.5mW;工作电压:50V;温度系数:±100ppm/℃;; LCSC Part Name: 332kΩ ±1% 62.5mW 厚膜电阻; Supplier Part: C44358; Manufacturer: UNI-ROYAL(厚声); Supplier Footprint: 0402; JLCPCB Part Class: 扩展库; Datasheet: https://item.szlcsc.com/datasheet/0402WGF3323TCE/45360.html; Supplier: LCSC; Type: 厚膜电阻; Tolerance: ±1%; Power(Watts): 62.5mW; Voltage-Supply(Max): 50V; Temperature Coefficient: ±100ppm/℃; Operating Temperature: -55℃~+155℃
R147 = RC0402FR-07102KL: 电阻类型:厚膜电阻;阻值:102kΩ;精度:±1%;功率:62.5mW;工作电压:50V;温度系数:±100ppm/℃;; LCSC Part Name: 厚膜电阻 102kΩ ±1% 62.5mW; Supplier Part: C188254; Manufacturer: YAGEO(国巨); Supplier Footprint: 0402; JLCPCB Part Class: 扩展库; Datasheet: https://item.szlcsc.com/datasheet/RC0402FR-07102KL/199661.html; Supplier: LCSC; Type: 厚膜电阻; Tolerance: ±1%; Power(Watts): 62.5mW; Voltage-Supply(Max): 50V; Temperature Coefficient: ±100ppm/℃; Operating Temperature: -55℃~+155℃
R149 R159 = 0402WGF4701TCE: 电阻类型:厚膜电阻;阻值:4.7kΩ;精度:±1%;功率:62.5mW;工作电压:50V;温度系数:±100ppm/℃;; LCSC Part Name: 4.7kΩ ±1% 62.5mW 厚膜电阻; Supplier Part: C25900; Manufacturer: UNI-ROYAL(厚声); Supplier Footprint: 0402; JLCPCB Part Class: 基础库; Datasheet: https://item.szlcsc.com/datasheet/0402WGF4701TCE/26643.html; Supplier: LCSC; Type: 厚膜电阻; Tolerance: ±1%; Power(Watts): 62.5mW; Voltage-Supply(Max): 50V; Temperature Coefficient: ±100ppm/℃; Operating Temperature: -55℃~+155℃
R151 = RC0402FR-07511KL: 电阻类型:厚膜电阻;阻值:511kΩ;精度:±1%;功率:62.5mW;最大工作电压:50V;温度系数:±100ppm/℃;; LCSC Part Name: 厚膜电阻 511kΩ ±1% 62.5mW; Supplier Part: C163461; Manufacturer: YAGEO(国巨); Supplier Footprint: 0402; JLCPCB Part Class: 扩展库; Datasheet: https://atta.szlcsc.com/upload/public/pdf/source/20181009/C309620_DA5935B6E1D48212CB7A533FE518B3C2.pdf; Supplier: LCSC; Type: 厚膜电阻; Tolerance: ±1%; Power(Watts): 62.5mW; Overload Voltage (Max): 50V; Temperature Coefficient: ±100ppm/℃; Operating Temperature Range: -55℃~+155℃
R152 = 0402WGF5112TCE: 电阻类型:厚膜电阻;阻值:51.1kΩ;精度:±1%;功率:62.5mW;最大工作电压:50V;温度系数:±100ppm/℃;; LCSC Part Name: 51.1kΩ ±1% 62.5mW 厚膜电阻; Supplier Part: C25904; Manufacturer: UNI-ROYAL(厚声); Supplier Footprint: 0402; JLCPCB Part Class: 扩展库; Datasheet: https://atta.szlcsc.com/upload/public/pdf/source/20200306/C422600_1E6D84923E4A46A82E41ADD87F860B5C.pdf; Supplier: LCSC; Type: 厚膜电阻; Tolerance: ±1%; Power(Watts): 62.5mW; Overload Voltage (Max): 50V; Temperature Coefficient: ±100ppm/℃; Operating Temperature Range: -55℃~+155℃
R153 = 0402WGF2002TCE: 电阻类型:厚膜电阻;阻值:20kΩ;精度:±1%;功率:62.5mW;最大工作电压:50V;温度系数:±100ppm/℃;; LCSC Part Name: 20kΩ ±1% 62.5mW 厚膜电阻; Supplier Part: C25765; Manufacturer: UNI-ROYAL(厚声); Supplier Footprint: 0402; JLCPCB Part Class: 基础库; Datasheet: https://atta.szlcsc.com/upload/public/pdf/source/20200306/C422600_1E6D84923E4A46A82E41ADD87F860B5C.pdf; Supplier: LCSC; Type: 厚膜电阻; Tolerance: ±1%; Power(Watts): 62.5mW; Overload Voltage (Max): 50V; Temperature Coefficient: ±100ppm/℃; Operating Temperature Range: -55℃~+155℃
R154 = 0402WGF4022TCE: 电阻类型:厚膜电阻;阻值:40.2kΩ;精度:±1%;功率:62.5mW;最大工作电压:50V;温度系数:±100ppm/℃;; LCSC Part Name: 40.2kΩ ±1% 62.5mW 厚膜电阻; Supplier Part: C25893; Manufacturer: UNI-ROYAL(厚声); Supplier Footprint: 0402; JLCPCB Part Class: 扩展库; Datasheet: https://atta.szlcsc.com/upload/public/pdf/source/20200306/C422600_1E6D84923E4A46A82E41ADD87F860B5C.pdf; Supplier: LCSC; Type: 厚膜电阻; Tolerance: ±1%; Power(Watts): 62.5mW; Overload Voltage (Max): 50V; Temperature Coefficient: ±100ppm/℃; Operating Temperature Range: -55℃~+155℃
R155 = 0402WGF6651TCE: 电阻类型:厚膜电阻;阻值:6.65kΩ;精度:±1%;功率:62.5mW;最大工作电压:50V;温度系数:±100ppm/℃;; LCSC Part Name: 6.65kΩ ±1% 62.5mW 厚膜电阻; Supplier Part: C45194; Manufacturer: UNI-ROYAL(厚声); Supplier Footprint: 0402; JLCPCB Part Class: 扩展库; Datasheet: https://atta.szlcsc.com/upload/public/pdf/source/20200306/C422600_1E6D84923E4A46A82E41ADD87F860B5C.pdf; Supplier: LCSC; Type: 厚膜电阻; Tolerance: ±1%; Power(Watts): 62.5mW; Overload Voltage (Max): 50V; Temperature Coefficient: ±100ppm/℃; Operating Temperature Range: -55℃~+155℃
R156 = 0402WGF6041TCE: 电阻类型:厚膜电阻;阻值:6.04kΩ;精度:±1%;功率:62.5mW;最大工作电压:50V;温度系数:±100ppm/℃;; LCSC Part Name: 6.04kΩ ±1% 62.5mW 厚膜电阻; Supplier Part: C25913; Manufacturer: UNI-ROYAL(厚声); Supplier Footprint: 0402; JLCPCB Part Class: 扩展库; Datasheet: https://atta.szlcsc.com/upload/public/pdf/source/20200306/C422600_1E6D84923E4A46A82E41ADD87F860B5C.pdf; Supplier: LCSC; Type: 厚膜电阻; Tolerance: ±1%; Power(Watts): 62.5mW; Overload Voltage (Max): 50V; Temperature Coefficient: ±100ppm/℃; Operating Temperature Range: -55℃~+155℃
R160 = 0402WGF7501TCE: 电阻类型:厚膜电阻;阻值:7.5kΩ;精度:±1%;功率:62.5mW;最大工作电压:50V;温度系数:±100ppm/℃;; LCSC Part Name: 7.5kΩ ±1% 62.5mW 厚膜电阻; Supplier Part: C25918; Manufacturer: UNI-ROYAL(厚声); Supplier Footprint: 0402; JLCPCB Part Class: 扩展库; Datasheet: https://atta.szlcsc.com/upload/public/pdf/source/20200306/C422600_1E6D84923E4A46A82E41ADD87F860B5C.pdf; Supplier: LCSC; Type: 厚膜电阻; Tolerance: ±1%; Power(Watts): 62.5mW; Overload Voltage (Max): 50V; Temperature Coefficient: ±100ppm/℃; Operating Temperature Range: -55℃~+155℃
R161 = 0402WGF3322TCE: 电阻类型:厚膜电阻;阻值:33.2kΩ;精度:±1%;功率:62.5mW;工作电压:50V;温度系数:±100ppm/℃;; LCSC Part Name: 33.2kΩ ±1% 62.5mW 厚膜电阻; Supplier Part: C122548; Manufacturer: UNI-ROYAL(厚声); Supplier Footprint: 0402; JLCPCB Part Class: 扩展库; Datasheet: https://item.szlcsc.com/datasheet/0402WGF3322TCE/123817.html; Supplier: LCSC; Type: 厚膜电阻; Tolerance: ±1%; Power(Watts): 62.5mW; Voltage-Supply(Max): 50V; Temperature Coefficient: ±100ppm/℃; Operating Temperature: -55℃~+155℃
SW2 = SS-12D10L5: 电路结构:单刀双掷;安装方式:直插;开关颜色:黑色;额定电流:3A;额定电压:125V;工作寿命:1万次;; LCSC Part Name: 柄长5mm 直插双档 滑动开关; Supplier Part: C319012; Manufacturer: XKB Connection(中国星坤); Supplier Footprint: 插件,13x6.8mm; JLCPCB Part Class: 扩展库; Datasheet: https://item.szlcsc.com/datasheet/SS-12D10L5/300104.html; Supplier: LCSC; Circuit: 单刀双掷; Actuator Style: 矩形柱状; Termination Style: PC引脚; Length: 13mm; Width: 6.8mm; Switch Height: 6.4mm; Mounting Type: 直插; Actuator Color: 黑色; Current Rating: 3A; Voltage Rating: 125V; Life: 1万次; Operating Temperature: -40℃~+85℃
U31-U33 U45 U47 = TPS82130SILR: 输入电压(DC):3V~17V;输出电压:900mV~6V;输出电流(最大值):3A;; Supplier Part: C473914; Manufacturer: TI(德州仪器); Supplier Footprint: USIP-8; JLCPCB Part Class: 扩展库; Datasheet: https://www.ti.com/cn/lit/gpn/tps82130; Supplier: LCSC; Output Channel: 1; Input Voltage(DC): 3V~17V; Output Voltage: 900mV~6V; Output Current (Max): 3A
U34 = ADP5074ACPZ-R7: 功能类型:-;输出类型:可调;工作电压:2.85V~15V;输出电压:-;输出电流:-;; LCSC Part Name: 2.4 A 反相DC-DC调节器; Supplier Part: C659272; Manufacturer: ADI(亚德诺); Supplier Footprint: LFCSP-16(3x3); JLCPCB Part Class: 扩展库; Datasheet: https://atta.szlcsc.com/upload/public/pdf/source/20200728/C659272_DB401E8FA3347C8C1A03DD4B016E5993.pdf; Supplier: LCSC; Output Type: 可调; Input Voltage: 2.85V~15V; Operating Temperature: -40℃~+125℃; Number of Outputs: 1; Topology: 反相式
U35 = DFLS240L: 二极管配置:独立式;正向压降(Vf):500mV@2A;直流反向耐压(Vr):40V;整流电流:2A;; LCSC Part Name: 电压:40V 电流:2A; Supplier Part: C5380706; Manufacturer: FUXINSEMI(富芯森美); Supplier Footprint: PowerDI-123; JLCPCB Part Class: 扩展库; Datasheet: https://item.szlcsc.com/datasheet/DFLS240L/6248470.html; Supplier: LCSC; Diode Configuration: 独立式; Voltage - Forward(Vf@If): 500mV@2A; Voltage - DC Reverse(Vr): 40V; Current - Rectified: 2A; Reverse Leakage Current (Ir): 100uA@40V; Operating Junction Temperature Range: -55℃~+125℃; Non-Repetitive Peak Forward Surge Current: 50A
U36 = XAL4020-222MEC: Supplier Part: C3151182; Manufacturer: Coilcraft(线艺); Supplier Footprint: SMD,4x4mm; JLCPCB Part Class: 扩展库; Datasheet: https://atta.szlcsc.com/upload/public/pdf/source/20231110/85A078131A04A3080D8D7E0D07D6A26C.pdf; Supplier: LCSC
U37 U38 U42 U43 = TPS7A8300ARGWR: 输出类型:可调;工作电压:6.5V;输出电压:800mV~5.2V;输出电流:2A;电源纹波抑制比(PSRR):-;输出极性:正极;; LCSC Part Name: 具有电源正常指示功能的 2A、低输入电压 (1.1V)、低噪声、高精度、超低压降稳压器; Supplier Part: C2860640; Manufacturer: TI(德州仪器); Supplier Footprint: VQFN-20(5x5); JLCPCB Part Class: 扩展库; Datasheet: https://www.ti.com/cn/lit/gpn/tps7a83a; Supplier: LCSC; Output Type: 可调; Maximum Input Voltage: 6.5V; Output Voltage: 800mV~5.2V; Output Current: 2A; Dropout Voltage: 300mV@(2A); standby current: 4mA; Feature: 防静电保护；浪涌保护；低ESR；热保护(TSD)；欠压闭锁；过流保护(OCP)；带使能；防倒灌; Operating Temperature: -40℃~+125℃@(Tj); Output Polarity: 正极; Number of Outputs: 1
U39 = TPS7A4701MRGWREP: 36V、1A、4μVRMS、射频 LDO 稳压器 20-VQFN -55 to 125; LCSC Part Name: 增强型产品，36V，1A，4uVRMS，RF LDO 电压调节器; Supplier Part: C2872670; Manufacturer: TI(德州仪器); Supplier Footprint: VQFN-20-EP(5x5); JLCPCB Part Class: 扩展库; Datasheet: https://www.ti.com/cn/lit/gpn/tps7a4701-ep; Supplier: LCSC
U40 = TPS7A3301RGWR: 输出类型:可调;最大输入电压:36V;输出电压:1.18V~33V;最大输出电流:1A;电源纹波抑制比(PSRR):72dB@(10kHz);输出极性:负极;; Supplier: LCSC; Supplier Part: C90082; Manufacturer: TI(德州仪器); JLCPCB Part Class: 扩展库; LCSC Part Name: ADJ 输入36V 输出1.18V~33V 1A; Supplier Footprint: VQFN-20-EP(5x5); Datasheet: https://www.ti.com/cn/lit/gpn/tps7a33; Output Type: 可调; Maximum Input Voltage: 36V; Output Voltage: 1.18V~33V; MAX Output Current: 1A; Power Supply Rejection Ratio (PSRR): 72dB@(10kHz); Dropout Voltage: 800mV@(1A); Output Polarity: 负极; Number of Outputs: 1
U41 = SPX3819M5-L-5-0/TR: 输出类型:固定;最大输入电压:16V;输出电压:5V;最大输出电流:500mA;电源纹波抑制比(PSRR):-;输出极性:正极;; LCSC Part Name: 输入16V 输出5V 500mA; Supplier Part: C13417; Manufacturer: MaxLinear(迈凌); Supplier Footprint: SOT-23-5; JLCPCB Part Class: 扩展库; Datasheet: https://atta.szlcsc.com/upload/public/pdf/source/20150720/1457707331934.pdf; Supplier: LCSC; Output Type: 固定; Voltage - Supply: 16V; Output Voltage: 5V; Output Current: 500mA; Voltage Dropout: 340mV@(500mA); standby current: 8uA; Noise: 40uVrms; Features: 带使能；过热保护；过流保护; Operating Temperature: -40℃~+125℃; Output Configuration: 正极; Number of Outputs: 1; Maximum Input Voltage: 16V; MAX Output Current: 500mA; Dropout Voltage: 700mV@(500mA); Output Polarity: 正极
U44 = TPS7A2033PDBVR: Supplier Part: C2862740; Manufacturer: TI(德州仪器); Supplier Footprint: SOT-23-5; JLCPCB Part Class: 扩展库; Datasheet: https://atta.szlcsc.com/upload/public/pdf/source/20230221/9B73099824E408F4B24BD95C528A27ED.pdf; Supplier: LCSC
U46 = TPS16630RGER: 额定电压:4.5V~60V;; Supplier Part: C1850279; Manufacturer: TI(德州仪器); Supplier Footprint: VQFN-24(4x4); JLCPCB Part Class: 扩展库; Datasheet: https://www.ti.com/cn/lit/gpn/tps1663; Supplier: LCSC; Voltage Rating: 4.5V~60V; Operating temperature: -40℃~+125℃@(Tj)
U48 = NCD0603R6: 发光颜色:红色;正向电压(VF):1.6V~2.4V;功率:65mW;正向电流:25mA;主波长:620nm~630nm;透镜颜色:无色透明透镜;发光强度:30mcd~80mcd;发光角度:140°;工作温度:-30℃~+85℃;; Supplier Part: C7429910; Manufacturer: 国星光电; Supplier Footprint: 0603; JLCPCB Part Class: 扩展库; Datasheet: https://atta.szlcsc.com/upload/public/pdf/source/20230620/13EAC00507632A35BC4A697CF03A06D7.pdf; Supplier: LCSC; Emitted Color: 红色; Forward Voltage (VF): 1.6V~2.4V; Power Dissipation: 65mW; Forward Current: 25mA; Dominant Wavelength: 620nm~630nm; Peak Wavelength: 630nm; Lens Color: 无色透明透镜; Luminous Intensity: 30mcd~80mcd; Viewing Angle: 140°; Operating Temperature: -30℃~+85℃
U59 = LT3094IDD#TRPBF: 输出类型:可调;工作电压:20V;输出电压:0V~19.5V;输出电流:500mA;电源纹波抑制比(PSRR):74dB@(1MHz);输出极性:负极;; LCSC Part Name: -20V、500mA、超低噪声、超高 PSRR 负线性稳压器; Supplier Part: C670499; Manufacturer: ADI(亚德诺); Supplier Footprint: DFN-12-EP(3x3); JLCPCB Part Class: 扩展库; Datasheet: https://item.szlcsc.com/datasheet/LT3094IDD%2523TRPBF/701590.html; Supplier: LCSC; Output Type: 可调; Voltage - Supply: 20V; Output Voltage: 0V~19.5V; Output Current: 500mA; Power Supply Rejection Ratio (PSRR): 74dB@(1MHz); Voltage Dropout: 235mV@(500mA); standby current: 2.35mA; Noise: 0.8uVrms; Features: PG脚；过热保护；过流保护；带使能; Operating Temperature: -40℃~+125℃; Output Configuration: 负极; Number of Outputs: 1

## Nets
2V1: C103.2 L6.3(OUT) L14.3(OUT) R139.1 U31.4(VOUT) U31.5(VOUT)
3V7: C104.2 L8.3(OUT) L16.3(OUT) L18.3(OUT) R140.1 U32.4(VOUT) U32.5(VOUT)
5V5: C105.2 L10.3(OUT) R141.1 U33.4(VOUT) U33.5(VOUT)
12V: C95.2 C96.1 C97.2 C98.2 C99.1 C100.1 C131.2 C139.1 C141.1 C143.2 C144.1 C149.2 C150.1 L5.3(OUT) U31.2(VIN) U32.2(VIN) U33.2(VIN) U41.1(IN) U41.3(EN) U45.2(VIN) U46.17(OUT) U46.18(OUT) U47.2(VIN) ; also on sheet 2
12VIN: C142.2 C145.2 D9.1(K) L19.2(CB) R149.2 R151.2 R153.2 R159.2 U46.1(IN) U46.2(IN) U46.5(P_IN)
-5V5: C107.2 L12.1(IN) L22.1(IN) R143.2 U35.2(A)
GND: C60.2 C61.2 C64.2 C65.2 C68.1 C69.1 C70.1 C71.1 C72.2 C74.2 C76.1 C77.1 C78.1 C79.1 C80.1 C81.1 C82.1 C83.1 C84.1 C85.1 C86.1 C87.1 C88.1 C89.1 C90.1 C91.1 C92.2 C93.2 C94.2 C95.1 C96.2 C97.1 C98.1 C99.2 C100.2 C101.2 C102.1 C103.1 C104.1 C105.1 C106.1 C107.1 C108.1 C109.1 C110.2 C111.1 C112.2 C113.2 C114.1 C115.1 C116.1 C118.1 C120.1 C121.1 C122.2 C123.2 C124.1 C125.1 C126.1 C127.1 C128.2 C129.1 C130.2 C131.1 C132.1 C133.1 C135.1 C137.2 C138.1 C139.2 C140.2 C141.2 C142.1 C143.1 C144.2 C145.1 C146.1 C147.2 C148.2 C149.1 C150.2 C151.1 C152.1 C153.1 C154.1 C155.1 C156.1 C157.1 C158.1 D1.1(Anode) D2.1(Anode) D3.1(Anode) D4.1(Anode) D5.1(Anode) D6.1(Anode) D7.1(Anode) D8.1(Anode) D9.2(A) D10.2(A) L5.2(GND) L5.4(GND) L6.2(GND) L6.4(GND) L7.2(GND) L7.4(GND) L8.2(GND) L8.4(GND) L9.2(GND) L9.4(GND) L10.2(GND) L10.4(GND) L11.2(GND) L11.4(GND) L12.2(GND) L12.4(GND) L13.2(GND) L13.4(GND) L14.2(GND) L14.4(GND) L15.2(GND) L15.4(GND) L16.2(GND) L16.4(GND) L17.2(GND) L17.4(GND) L18.2(GND) L18.4(GND) L19.4(CG) L20.2(GND) L21.2(GND) L22.2(GND) L22.4(GND) L23.2(GND) L23.4(GND) LED1.1(-) R95.1 R96.2 R103.2 R106.1 R113.2 R114.2 R120.1 R124.1 R136.2 R137.2 R138.2 R147.2 R148.2 R154.2 R155.1 R156.2 R157.2 R160.1 R161.1 U23.17(EP) U24.17(EP) U25.1 U25.2 U25.3 U25.4 U26.1 U26.2 U26.3 U26.4 U27.17(EP) U28.17(EP) U29.1 U29.2 U29.3 U29.4 U30.1 U30.2 U30.3 U30.4 U31.3(GND) U31.9(EP) U32.3(GND) U32.9(EP) U33.3(GND) U33.9(EP) U34.10(GND) U34.14(NIC) U34.15(NIC) U34.16(NIC) U34.17(EP) U36.2 U37.7(200mV) U37.8(GND) U37.10(800mV) U37.18(GND) U37.21(EP) U38.6(100mV) U38.8(GND) U38.10(800mV) U38.11(1.6V) U38.18(GND) U38.21(EP) U39.6(3P2V) U39.7(GND) U39.10(0P4V) U39.17(NC) U39.18(NC) U39.19(NC) U39.21(EP) U40.2(NC) U40.4(NC) U40.5(NC) U40.6(NC) U40.7(GND) U40.8(NC) U40.9(NC) U40.10(NC) U40.11(NC) U40.12(NC) U40.17(NC) U40.18(NC) U40.19(NC) U40.21(EPAD) U41.2(GND) U42.7(200mV) U42.8(GND) U42.10(800mV) U42.18(GND) U42.21(EP) U43.6(100mV) U43.8(GND) U43.10(800mV) U43.11(1.6V) U43.18(GND) U43.21(EP) U44.2(GND) U45.3(GND) U45.9(EP) U46.8(GND) U46.11(MODE) U46.25(EP) U47.3(GND) U47.9(EP) U57.48(PDWN) U57.65(EP) U58.48(PDWN) U58.65(EP) U59.9(GND) ; also on sheet 2 3
GNDIN: DC1.1 DC1.2 L19.3(PSG)
VEE_3V3: C152.2 C153.2 C154.2 C155.2 L23.3(OUT) U23.13(–VS) U23.14(–VS) U23.15(–VS) U23.16(–VS) U24.13(–VS) U24.14(–VS) U24.15(–VS) U24.16(–VS) U27.13(–VS) U27.14(–VS) U27.15(–VS) U27.16(–VS) U28.13(–VS) U28.14(–VS) U28.15(–VS) U28.16(–VS)
VIN: DC1.3 SW2.2
VINSW: L19.1(B) SW2.3
ADC1_CHA_N: C58.1 D3.3(Anode/Cathode) R109.1 U57.52(VIN-A)
ADC1_CHA_P: C58.2 D1.3(Anode/Cathode) R105.1 U57.51(VIN+A)
ADC1_CHB_N: C62.2 D5.3(Anode/Cathode) R123.1 U57.61(VIN-B)
ADC1_CHB_P: C62.1 D7.3(Anode/Cathode) R127.1 U57.62(VIN+B)
ADC1_CLK_N: C67.2 ; also on sheet 2
ADC1_CLK_P: C66.2 ; also on sheet 2
ADC1_CS: U57.46(CSB) ; also on sheet 2
ADC1_DCO_N: U57.24(DCO-) ; also on sheet 2
ADC1_DCO_P: U57.25(DCO+) ; also on sheet 2
ADC1_OE: U57.47(OEB) ; also on sheet 2
ADC1_ORA_N: U57.42(ORA-) ; also on sheet 2
ADC1_ORA_P: U57.43(ORA+) ; also on sheet 2
ADC1_ORB_N: U57.6(ORB-) ; also on sheet 2
ADC1_ORB_P: U57.7(ORB+) ; also on sheet 2
ADC1_SCLK: U57.45(SCLK) ; also on sheet 2
ADC1_SDIO: U57.44(SDIO) ; also on sheet 2
ADC1_SYNC: U57.3(SYNC) ; also on sheet 2
ADC1_VCM: C72.1 R111.2 R129.2 U57.57(VCM)
ADC2_CHA_N: C59.1 D4.3(Anode/Cathode) R110.1 U58.52(VIN-A)
ADC2_CHA_P: C59.2 D2.3(Anode/Cathode) R108.1 U58.51(VIN+A)
ADC2_CHB_N: C63.2 D6.3(Anode/Cathode) R126.1 U58.61(VIN-B)
ADC2_CHB_P: C63.1 D8.3(Anode/Cathode) R128.1 U58.62(VIN+B)
ADC2_CLK_N: C75.2 ; also on sheet 2
ADC2_CLK_P: C73.2 ; also on sheet 2
ADC2_CS: U58.46(CSB) ; also on sheet 2
ADC2_DCO_N: U58.24(DCO-) ; also on sheet 2
ADC2_DCO_P: U58.25(DCO+) ; also on sheet 2
ADC2_OE: U58.47(OEB) ; also on sheet 2
ADC2_ORA_N: U58.42(ORA-) ; also on sheet 2
ADC2_ORA_P: U58.43(ORA+) ; also on sheet 2
ADC2_ORB_N: U58.6(ORB-) ; also on sheet 2
ADC2_ORB_P: U58.7(ORB+) ; also on sheet 2
ADC2_SCLK: U58.45(SCLK) ; also on sheet 2
ADC2_SDIO: U58.44(SDIO) ; also on sheet 2
ADC2_SYNC: U58.3(SYNC) ; also on sheet 2
ADC2_VCM: C74.1 R112.2 R130.2 U58.57(VCM)
ADC_A1V8: C76.2 C77.2 C78.2 C79.2 C84.2 C85.2 C86.2 C87.2 D1.2(Cathode) D2.2(Cathode) D3.2(Cathode) D4.2(Cathode) D5.2(Cathode) D6.2(Cathode) D7.2(Cathode) D8.2(Cathode) L15.1(IN) U57.49(AVDD) U57.50(AVDD) U57.53(AVDD) U57.54(AVDD) U57.59(AVDD) U57.60(AVDD) U57.63(AVDD) U57.64(AVDD) U58.49(AVDD) U58.50(AVDD) U58.53(AVDD) U58.54(AVDD) U58.59(AVDD) U58.60(AVDD) U58.63(AVDD) U58.64(AVDD)
ADC_A3V3: C68.2 C69.2 C70.2 C71.2 L9.1(IN) U23.5(+VS) U23.6(+VS) U23.7(+VS) U23.8(+VS) U23.12(PD#) U24.5(+VS) U24.6(+VS) U24.7(+VS) U24.8(+VS) U24.12(PD#) U27.5(+VS) U27.6(+VS) U27.7(+VS) U27.8(+VS) U27.12(PD#) U28.5(+VS) U28.6(+VS) U28.7(+VS) U28.8(+VS) U28.12(PD#)
ADC_D1V8: C80.2 C81.2 C82.2 C83.2 C88.2 C89.2 C90.2 C91.2 L7.1(IN) U57.10(DRVDD) U57.19(DRVDD) U57.28(DRVDD) U57.37(DRVDD) U58.10(DRVDD) U58.19(DRVDD) U58.28(DRVDD) U58.37(DRVDD)
B65_L1_N: U58.21(D5+) ; also on sheet 2
B65_L1_P: U58.20(D5-) ; also on sheet 2
B65_L2_N: U58.23(D6+) ; also on sheet 2
B65_L2_P: U58.22(D6-) ; also on sheet 2
B65_L3_N: U58.18(D4+) ; also on sheet 2
B65_L3_P: U58.17(D4-) ; also on sheet 2
B65_L4_N: U58.26(D7-) ; also on sheet 2
B65_L4_P: U58.27(D7+) ; also on sheet 2
B65_L5_N: U58.8((LSB)D0–) ; also on sheet 2
B65_L5_P: U58.9((LSB)D0+) ; also on sheet 2
B65_L6_N: U58.11(D1-) ; also on sheet 2
B65_L6_P: U58.12(D1+) ; also on sheet 2
B65_L7_N: U58.16(D3+) ; also on sheet 2
B65_L7_P: U58.15(D3-) ; also on sheet 2
B65_L8_N: U58.38(D12-) ; also on sheet 2
B65_L8_P: U58.39(D12+) ; also on sheet 2
B65_L9_N: U58.36(D11+) ; also on sheet 2
B65_L9_P: U58.35(D11-) ; also on sheet 2
B65_L10_N: U58.41(D13+(MSB)) ; also on sheet 2
B65_L10_P: U58.40(D13-(MSB)) ; also on sheet 2
B65_L11_N: U58.32(D9+) ; also on sheet 2
B65_L11_P: U58.31(D9-) ; also on sheet 2
B65_L16_N: U58.13(D2-) ; also on sheet 2
B65_L16_P: U58.14(D2+) ; also on sheet 2
B65_L17_N: U58.30(D8+) ; also on sheet 2
B65_L17_P: U58.29(D8-) ; also on sheet 2
B65_L19_N: U58.34(D10+) ; also on sheet 2
B65_L19_P: U58.33(D10-) ; also on sheet 2
B66_L1_N: U57.20(D5-) ; also on sheet 2
B66_L1_P: U57.21(D5+) ; also on sheet 2
B66_L2_N: U57.8((LSB)D0–) ; also on sheet 2
B66_L2_P: U57.9((LSB)D0+) ; also on sheet 2
B66_L5_N: U57.11(D1-) ; also on sheet 2
B66_L5_P: U57.12(D1+) ; also on sheet 2
B66_L6_N: U57.33(D10-) ; also on sheet 2
B66_L6_P: U57.34(D10+) ; also on sheet 2
B66_L7_N: U57.13(D2-) ; also on sheet 2
B66_L7_P: U57.14(D2+) ; also on sheet 2
B66_L8_N: U57.15(D3-) ; also on sheet 2
B66_L8_P: U57.16(D3+) ; also on sheet 2
B66_L9_N: U57.17(D4-) ; also on sheet 2
B66_L9_P: U57.18(D4+) ; also on sheet 2
B66_L10_N: U57.26(D7-) ; also on sheet 2
B66_L10_P: U57.27(D7+) ; also on sheet 2
B66_L11_N: U57.22(D6-) ; also on sheet 2
B66_L11_P: U57.23(D6+) ; also on sheet 2
B66_L14_N: U57.38(D12-) ; also on sheet 2
B66_L14_P: U57.39(D12+) ; also on sheet 2
B66_L15_N: U57.41(D13+(MSB)) ; also on sheet 2
B66_L15_P: U57.40(D13-(MSB)) ; also on sheet 2
B66_L16_N: U57.35(D11-) ; also on sheet 2
B66_L16_P: U57.36(D11+) ; also on sheet 2
B66_L19_N: U57.29(D8-) ; also on sheet 2
B66_L19_P: U57.30(D8+) ; also on sheet 2
B66_L20_N: U57.31(D9-) ; also on sheet 2
B66_L20_P: U57.32(D9+) ; also on sheet 2
DAC_A3V3: L17.1(IN) ; also on sheet 3
DAC_AVCC: L11.1(IN) ; also on sheet 3
DAC_AVEE: C124.2 L13.3(OUT) ; also on sheet 3
DAC_D3V3: C138.2 U44.5(OUT) ; also on sheet 3
FLT: U46.14(FLT#) U48.1(-)
FPGA_1V8: L20.3(OUT) ; also on sheet 2
FPGA_3V3: L21.3(OUT) ; also on sheet 2
LOGIC_5V: C126.2 R133.1 R134.1 R135.1 U41.5(OUT) ; also on sheet 2
PG: LED1.2(+) R149.1 U46.16(PGOOD)
PG_2V1: R133.2 U31.7(PG) U37.14(EN) U42.14(EN)
PG_3V7: R134.2 U32.7(PG) U38.14(EN) U43.14(EN) U44.3(EN)
PG_5V5: R135.2 U33.7(PG) U39.13(EN)
PWR_EN: U31.1(EN) U32.1(EN) U33.1(EN) U34.6(EN) U45.1(EN) U47.1(EN) ; also on sheet 2
VREG: C106.2 R144.2 U34.4(SYNC/FREQ) U34.11(VREG)
$4N2889: R97.1 R100.2 U23.2(+IN)
$4N2892: R99.2 R104.1 U23.3(-IN)
$4N2899: R109.2 U23.10(+OUT)
$4N2900: R105.2 U23.11(-OUT)
$4N5271: C60.1 R111.1 U23.9(VOCM)
$4N5945: R115.1 R117.2 U27.2(+IN)
$4N5946: R116.2 R121.1 U27.3(-IN)
$4N5949: R127.2 U27.10(+OUT)
$4N5950: R123.2 U27.11(-OUT)
$4N5957: R113.1 R117.1 U29.5
$4N5966: C64.1 R129.1 U27.9(VOCM)
$4N6204: C66.1 R131.2 U57.1(CLK+)
$4N6213: C67.1 R131.1 U57.2(CLK-)
$4N7666: C73.1 R132.2 U58.1(CLK+)
$4N7670: C75.1 R132.1 U58.2(CLK-)
$4N10596: R98.1 R102.2 U24.2(+IN)
$4N10597: R101.2 R107.1 U24.3(-IN)
$4N10599: R101.1 R106.2 U26.5
$4N10600: R110.2 U24.10(+OUT)
$4N10601: R108.2 U24.11(-OUT)
$4N10613: C61.1 R112.1 U24.9(VOCM)
$4N10616: R118.2 R119.1 U28.2(+IN)
$4N10617: R122.2 R125.1 U28.3(-IN)
$4N10620: R128.2 U28.10(+OUT)
$4N10621: R126.2 U28.11(-OUT)
$4N10627: R114.1 R118.1 U30.5
$4N10633: C65.1 R130.1 U28.9(VOCM)
$4N32161: R99.1 R103.1 U25.5
$4N60322: R116.1 R120.2
$4N60435: R95.2 R100.1
$4N60511: R96.1 R102.1
$4N60587: R122.1 R124.2
$4N60663: R125.2 U28.4(+FB)
$4N60702: R119.2 U28.1(–FB)
$4N60741: R107.2 U24.4(+FB)
$4N60780: R98.2 U24.1(–FB)
$4N60819: R97.2 U23.1(–FB)
$4N60858: R104.2 U23.4(+FB)
$4N60897: R115.2 U27.1(–FB)
$4N60936: R121.2 U27.4(+FB)
$5N372: C92.1 U31.8(SS/TR)
$5N376: R136.1 R139.2 U31.6(FB)
$5N1240: C114.2 C115.2 L11.3(OUT) U39.1(OUT) U39.3(SENSE/FB) U39.20(OUT)
$5N1242: C113.1 L10.1(IN) U39.15(IN) U39.16(IN)
$5N1243: C120.2 U39.14(NR)
$5N3293: C110.1 C117.2 L7.3(OUT) U37.1(OUT) U37.2(SNS) U37.19(OUT) U37.20(OUT)
$5N3298: C116.2 U37.13(NR/SS)
$5N3299: C117.1 U37.3(FB)
$5N3302: C109.2 L6.1(IN) U37.15(IN) U37.16(IN) U37.17(IN)
$5N5183: C128.1 C134.2 L15.3(OUT) U42.1(OUT) U42.2(SNS) U42.19(OUT) U42.20(OUT)
$5N5194: C133.2 U42.13(NR/SS)
$5N5195: C134.1 U42.3(FB)
$5N5197: C127.2 L14.1(IN) U42.15(IN) U42.16(IN) U42.17(IN)
$5N5607: C93.1 U32.8(SS/TR)
$5N5611: R137.1 R140.2 U32.6(FB)
$5N6066: C112.1 C119.2 L9.3(OUT) U38.1(OUT) U38.2(SNS) U38.19(OUT) U38.20(OUT)
$5N6077: C118.2 U38.13(NR/SS)
$5N6078: C119.1 U38.3(FB)
$5N6080: C111.2 L8.1(IN) U38.15(IN) U38.16(IN) U38.17(IN)
$5N6556: C130.1 C136.2 L17.3(OUT) U43.1(OUT) U43.2(SNS) U43.19(OUT) U43.20(OUT)
$5N6567: C135.2 U43.13(NR/SS)
$5N6568: C136.1 U43.3(FB)
$5N6570: C129.2 L16.1(IN) U43.15(IN) U43.16(IN) U43.17(IN)
$5N7315: C137.1 L18.1(IN) U44.1(IN)
$5N7716: C94.1 U33.8(SS/TR)
$5N7720: R138.1 R141.2 U33.6(FB)
$5N17121: U34.1(SW) U35.1(C) U36.1
$5N17594: C108.2 R145.1
$5N17668: R144.1 U34.3(PWRGD)
$5N17677: R145.2 U34.7(COMP)
$5N17856: C102.2 L5.1(IN) U34.12(PVIN) U34.13(AVIN)
$5N18042: C101.1 R142.2 U34.9(VREF)
$5N18237: R142.1 R143.1 U34.8(FB)
$5N31714: C121.2 L12.3(OUT) U40.13(EN) U40.15(IN) U40.16(IN)
$5N31775: C125.2 U40.14(NR/SS)
$5N31873: C122.1 C123.1 L13.1(IN) R146.2 U40.1(OUT) U40.20(OUT)
$5N31890: R146.1 R147.1 U40.3(FB)
$5N41018: C132.2 U41.4(BYP)
$5N50290: R151.1 R152.2 U46.6(UVLO)
$5N50291: R152.1 R154.1 U46.7(OVP)
$5N50294: R156.1 U46.10(ILIM)
$5N50297: C147.1 U46.9(dVdT)
$5N50299: D10.1(K) R153.1 R155.2 U46.12(SHDN#)
$5N50572: R159.1 U48.2(+)
$5N51378: C140.1 U45.8(SS/TR)
$5N51382: R148.1 R150.2 U45.6(FB)
$5N51687: C148.1 U47.8(SS/TR)
$5N51691: R157.1 R158.2 U47.6(FB)
$5N56018: C151.2 L21.1(IN) R158.1 U47.4(VOUT) U47.5(VOUT)
$5N56091: C146.2 L20.1(IN) R150.1 U45.4(VOUT) U45.5(VOUT)
$5N75203: C156.2 L22.3(OUT) U59.1(IN) U59.2(IN) U59.3(EN/UV) U59.5(PGFB) U59.13(IN)
$5N75274: C157.2 L23.1(IN) U59.10(OUTS) U59.11(OUT) U59.12(OUT)
$5N75455: R160.2 U59.6(ILIM)
$5N75681: C158.2 R161.2 U59.8(SET)

Not connected (* = marked no-connect by the designer): SW2 1*; U34 2(SLEW)* 5(SS)*; U37 4(PG)* 5(50mV)* 6(100mV)* 9(400mV)* 11(1.6V)* 12(BIAS)*; U38 4(PG)* 5(50mV)* 7(200mV)* 9(400mV)* 12(BIAS)*; U39 2(NC)* 4(6P4V2)* 5(6P4V1)* 8(1P6V)* 9(0P8V)* 11(0P2V)* 12(0P1V)*; U42 4(PG)* 5(50mV)* 6(100mV)* 9(400mV)* 11(1.6V)* 12(BIAS)*; U43 4(PG)* 5(50mV)* 7(200mV)* 9(400mV)* 12(BIAS)*; U44 4(NC)*; U45 7(PG)*; U46 3(N.C)* 4(N.C)* 13(IMON)* 15(N.C)* 19(N.C)* 20(N.C)* 21(N.C)* 22(N.C)* 23(N.C)* 24(N.C)*; U47 7(PG)*; U57 4(DNC)* 5(DNC)* 55(DNC)* 56(DNC)* 58(DNC)*; U58 4(DNC)* 5(DNC)* 55(DNC)* 56(DNC)* 58(DNC)*; U59 4(PG)* 7(VIOC)*

## Notes on the sheets
sheet 5
- POWER 1V8
- POWER 3V3
- POWER ±5V
- POWER FILTER
- POWER SW
- ilim=2.4A
- Vov=15.5V Vuv=7.45V
- POWER FILTER
- FPGA IO POWER
- FPGA IO POWER
